# EasyEDA Pro project RoboHotHouse.eprj

# Schematic Schematic1
Board Name: TestRelay; Create Date: 2025-10-12; Page Name: P1; Project Name: RoboHotHouse; Schematic Name: Schematic1; Update Date: 2025-10-13; Company: EasyEDA.com; Page Size: A4; Version: V1.0
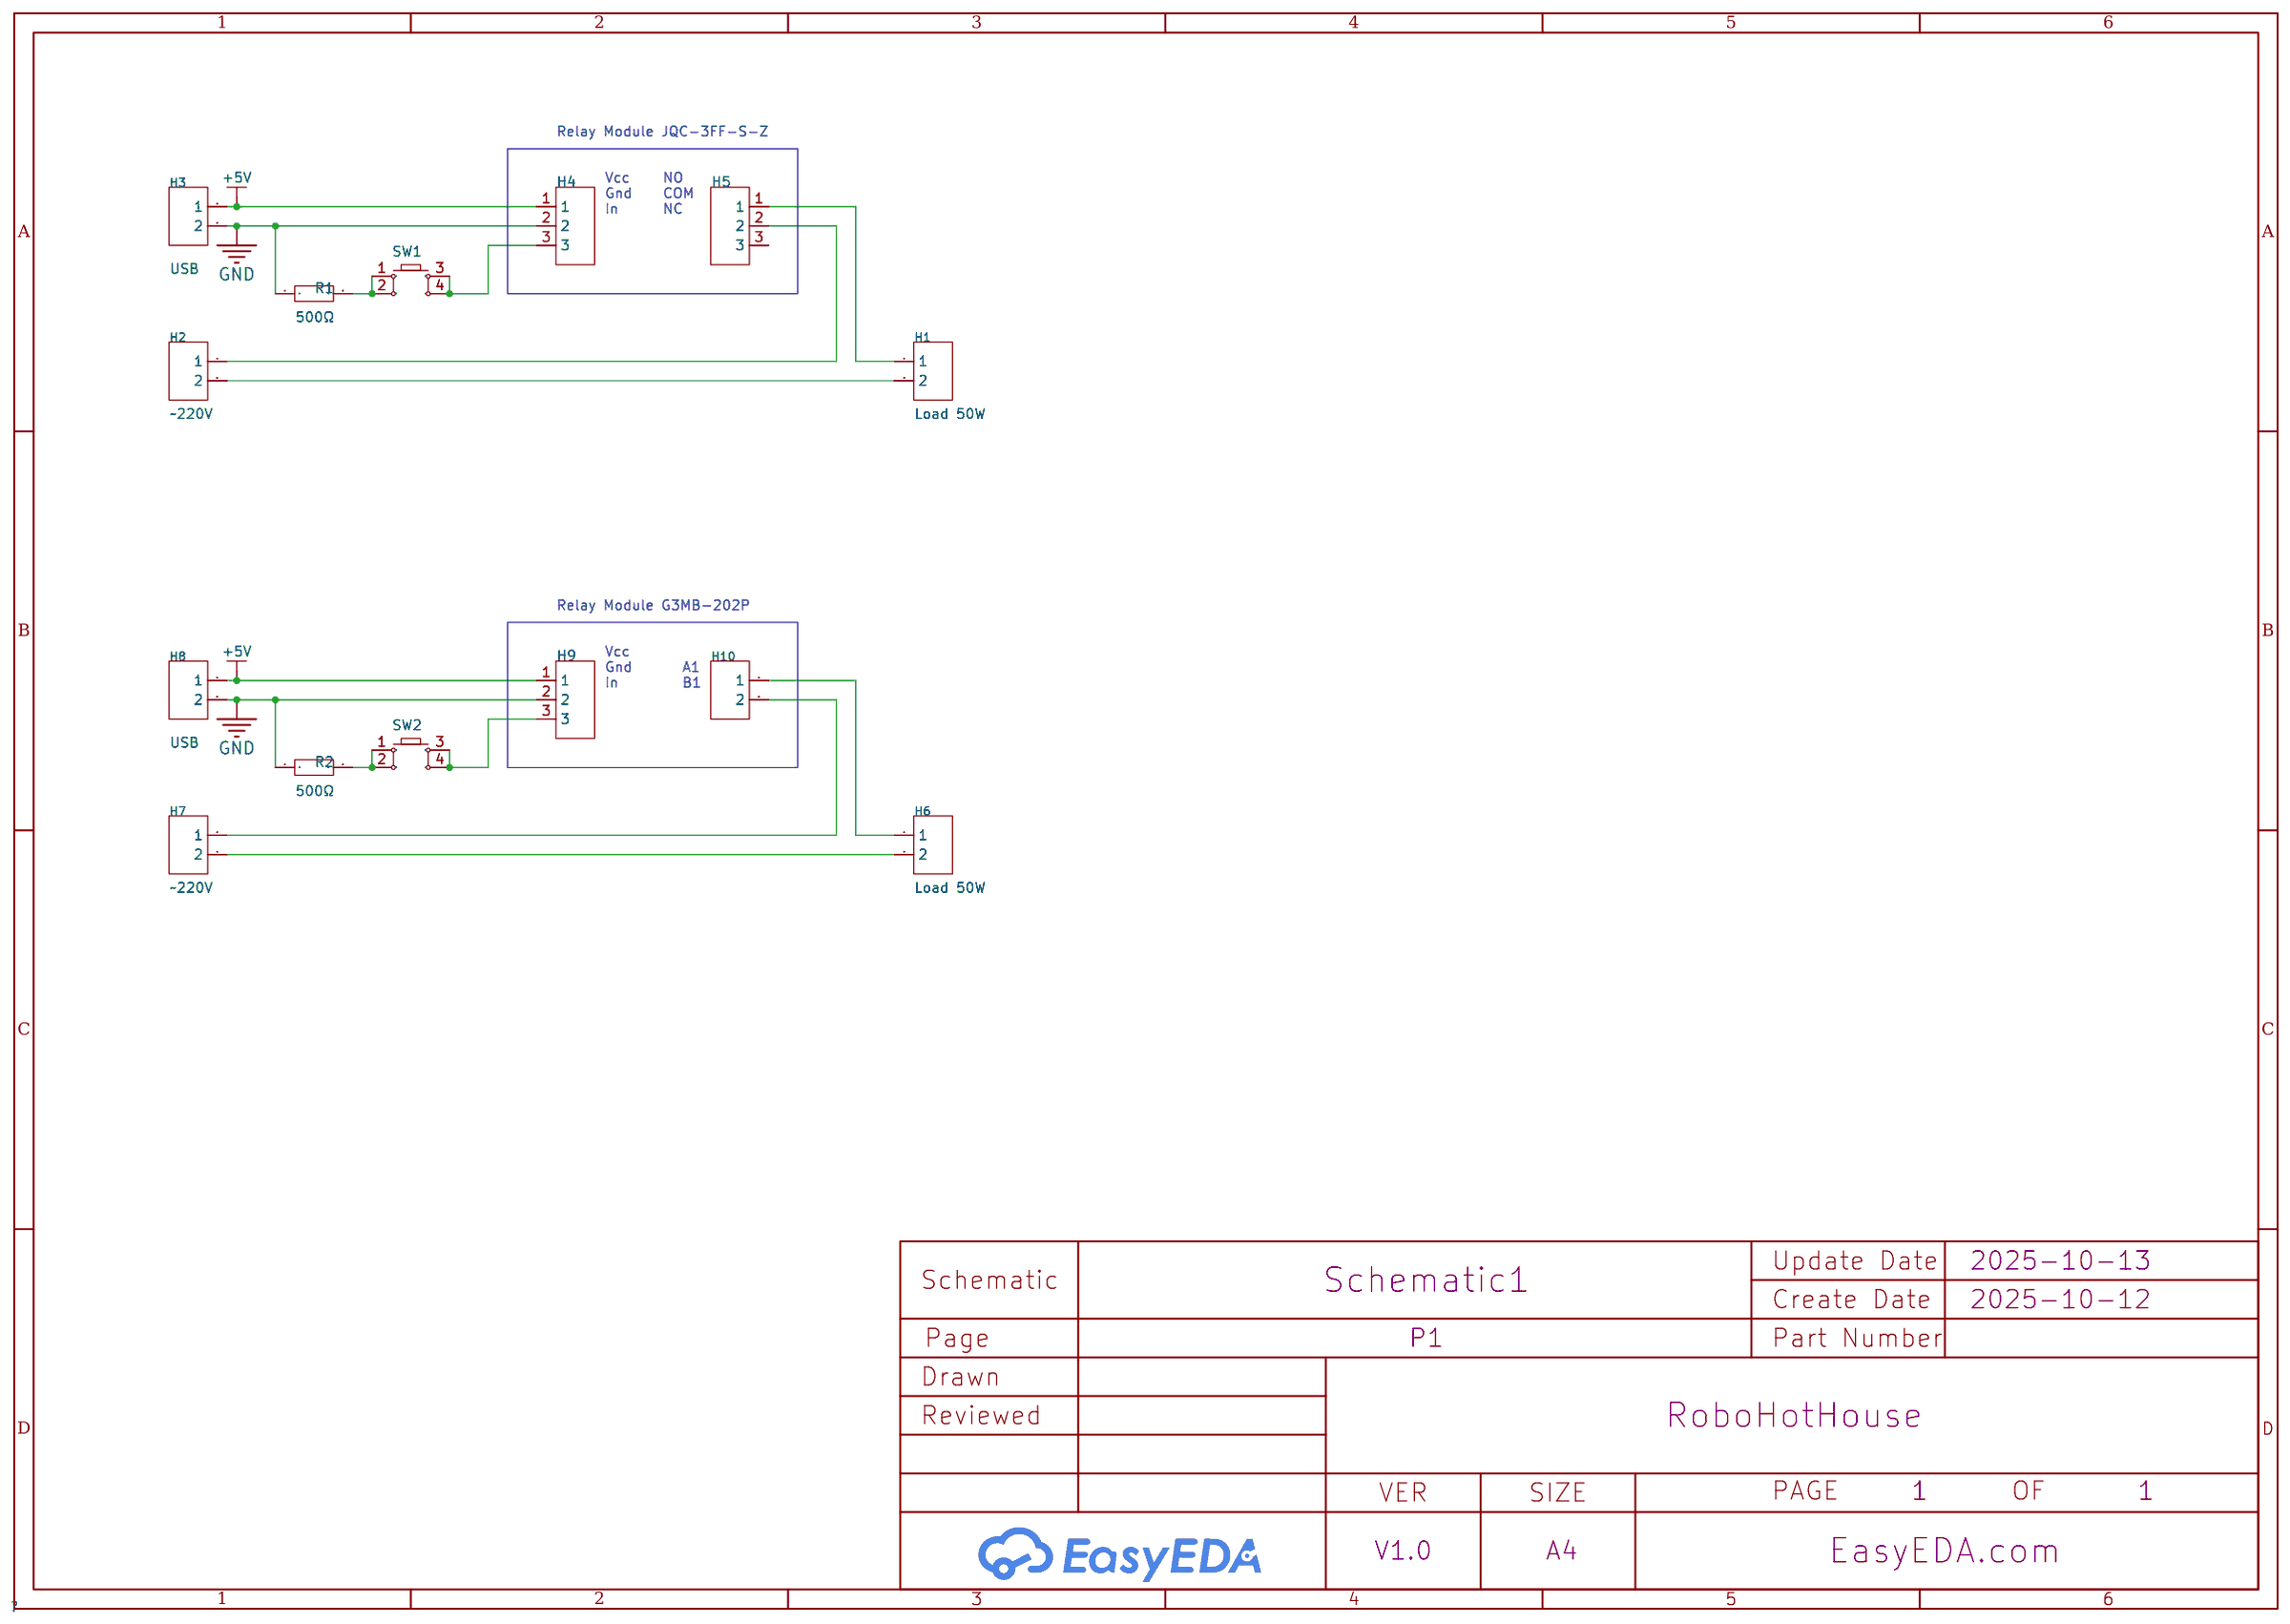
[diagram p0: schematic sheet]

## Parts
H1  Load 50W  [HDR-TH_2P-P2.54-V-F]
H2  220V  [HDR-TH_2P-P2.54-V-F]
H3  USB  [HDR-TH_2P-P2.54-V-F]
H4  -  [HDR-TH_3P-P2.54-V-F]
H5  -  [HDR-TH_3P-P2.54-V-F]
H6  Load 50W  [HDR-TH_2P-P2.54-V-F]
H7  220V  [HDR-TH_2P-P2.54-V-F]
H8  USB  [HDR-TH_2P-P2.54-V-F]
H9  -  [HDR-TH_3P-P2.54-V-F]
H10  -  [HDR-TH_2P-P2.54-V-F]
R1  500Ω  [RES-TH_BD1.8-L3.2-P7.20-D0.4]
R2  500Ω  [RES-TH_BD1.8-L3.2-P7.20-D0.4]
SW1  -  [KEY-TH_4P-L6.0-W6.0-P3.90-LS6.5]
SW2  -  [KEY-TH_4P-L6.0-W6.0-P3.90-LS6.5]

## Library data of the parts
H1-H3 H6-H8 H10 = HDR-F_2.54_1x2P: Supplier Footprint: Through
H4 H5 H9 = HDR-F_2.54_1x3P: Supplier Footprint: Through
R1 R2 = Res_AXIAL-1/8W: Supplier Footprint: Through
SW1 SW2 = Key_TH_6x6x4.5: Supplier Footprint: Through

## Nets
+5V: H3.1 H4.1 H8.1 H9.1
GND: H3.2 H4.2 H8.2 H9.2 R1.1 R2.1
Net-(H1-1): H1.1 H5.1
Net-(H1-2): H1.2 H2.2
Net-(H2-1): H2.1 H5.2
Net-(H4-3): H4.3 SW1.3 SW1.4
Net-(H6-1): H6.1 H10.1
Net-(H6-2): H6.2 H7.2
Net-(H7-1): H7.1 H10.2
Net-(H9-3): H9.3 SW2.3 SW2.4
Net-(R1-2): R1.2 SW1.1 SW1.2
Net-(R2-2): R2.2 SW2.1 SW2.2

Not connected (* = marked no-connect by the designer): H5 3

## Notes on the sheet
- Relay Module JQC-3FF-S-Z
- Vcc
  Gnd
  In
- NO
  COM
  NC
- Relay Module G3MB-202P
- Vcc
  Gnd
  In
- A1
  B1

# Schematic Schematic2

## Sheets
1 P1: Board Name: HotHouseProto; Create Date: 2025-11-25; Page Name: P1; Project Name: RoboHotHouse; Schematic Name: Schematic2; Update Date: 2025-11-30; Company: EasyEDA.com; Page Size: A4; Version: V1.0
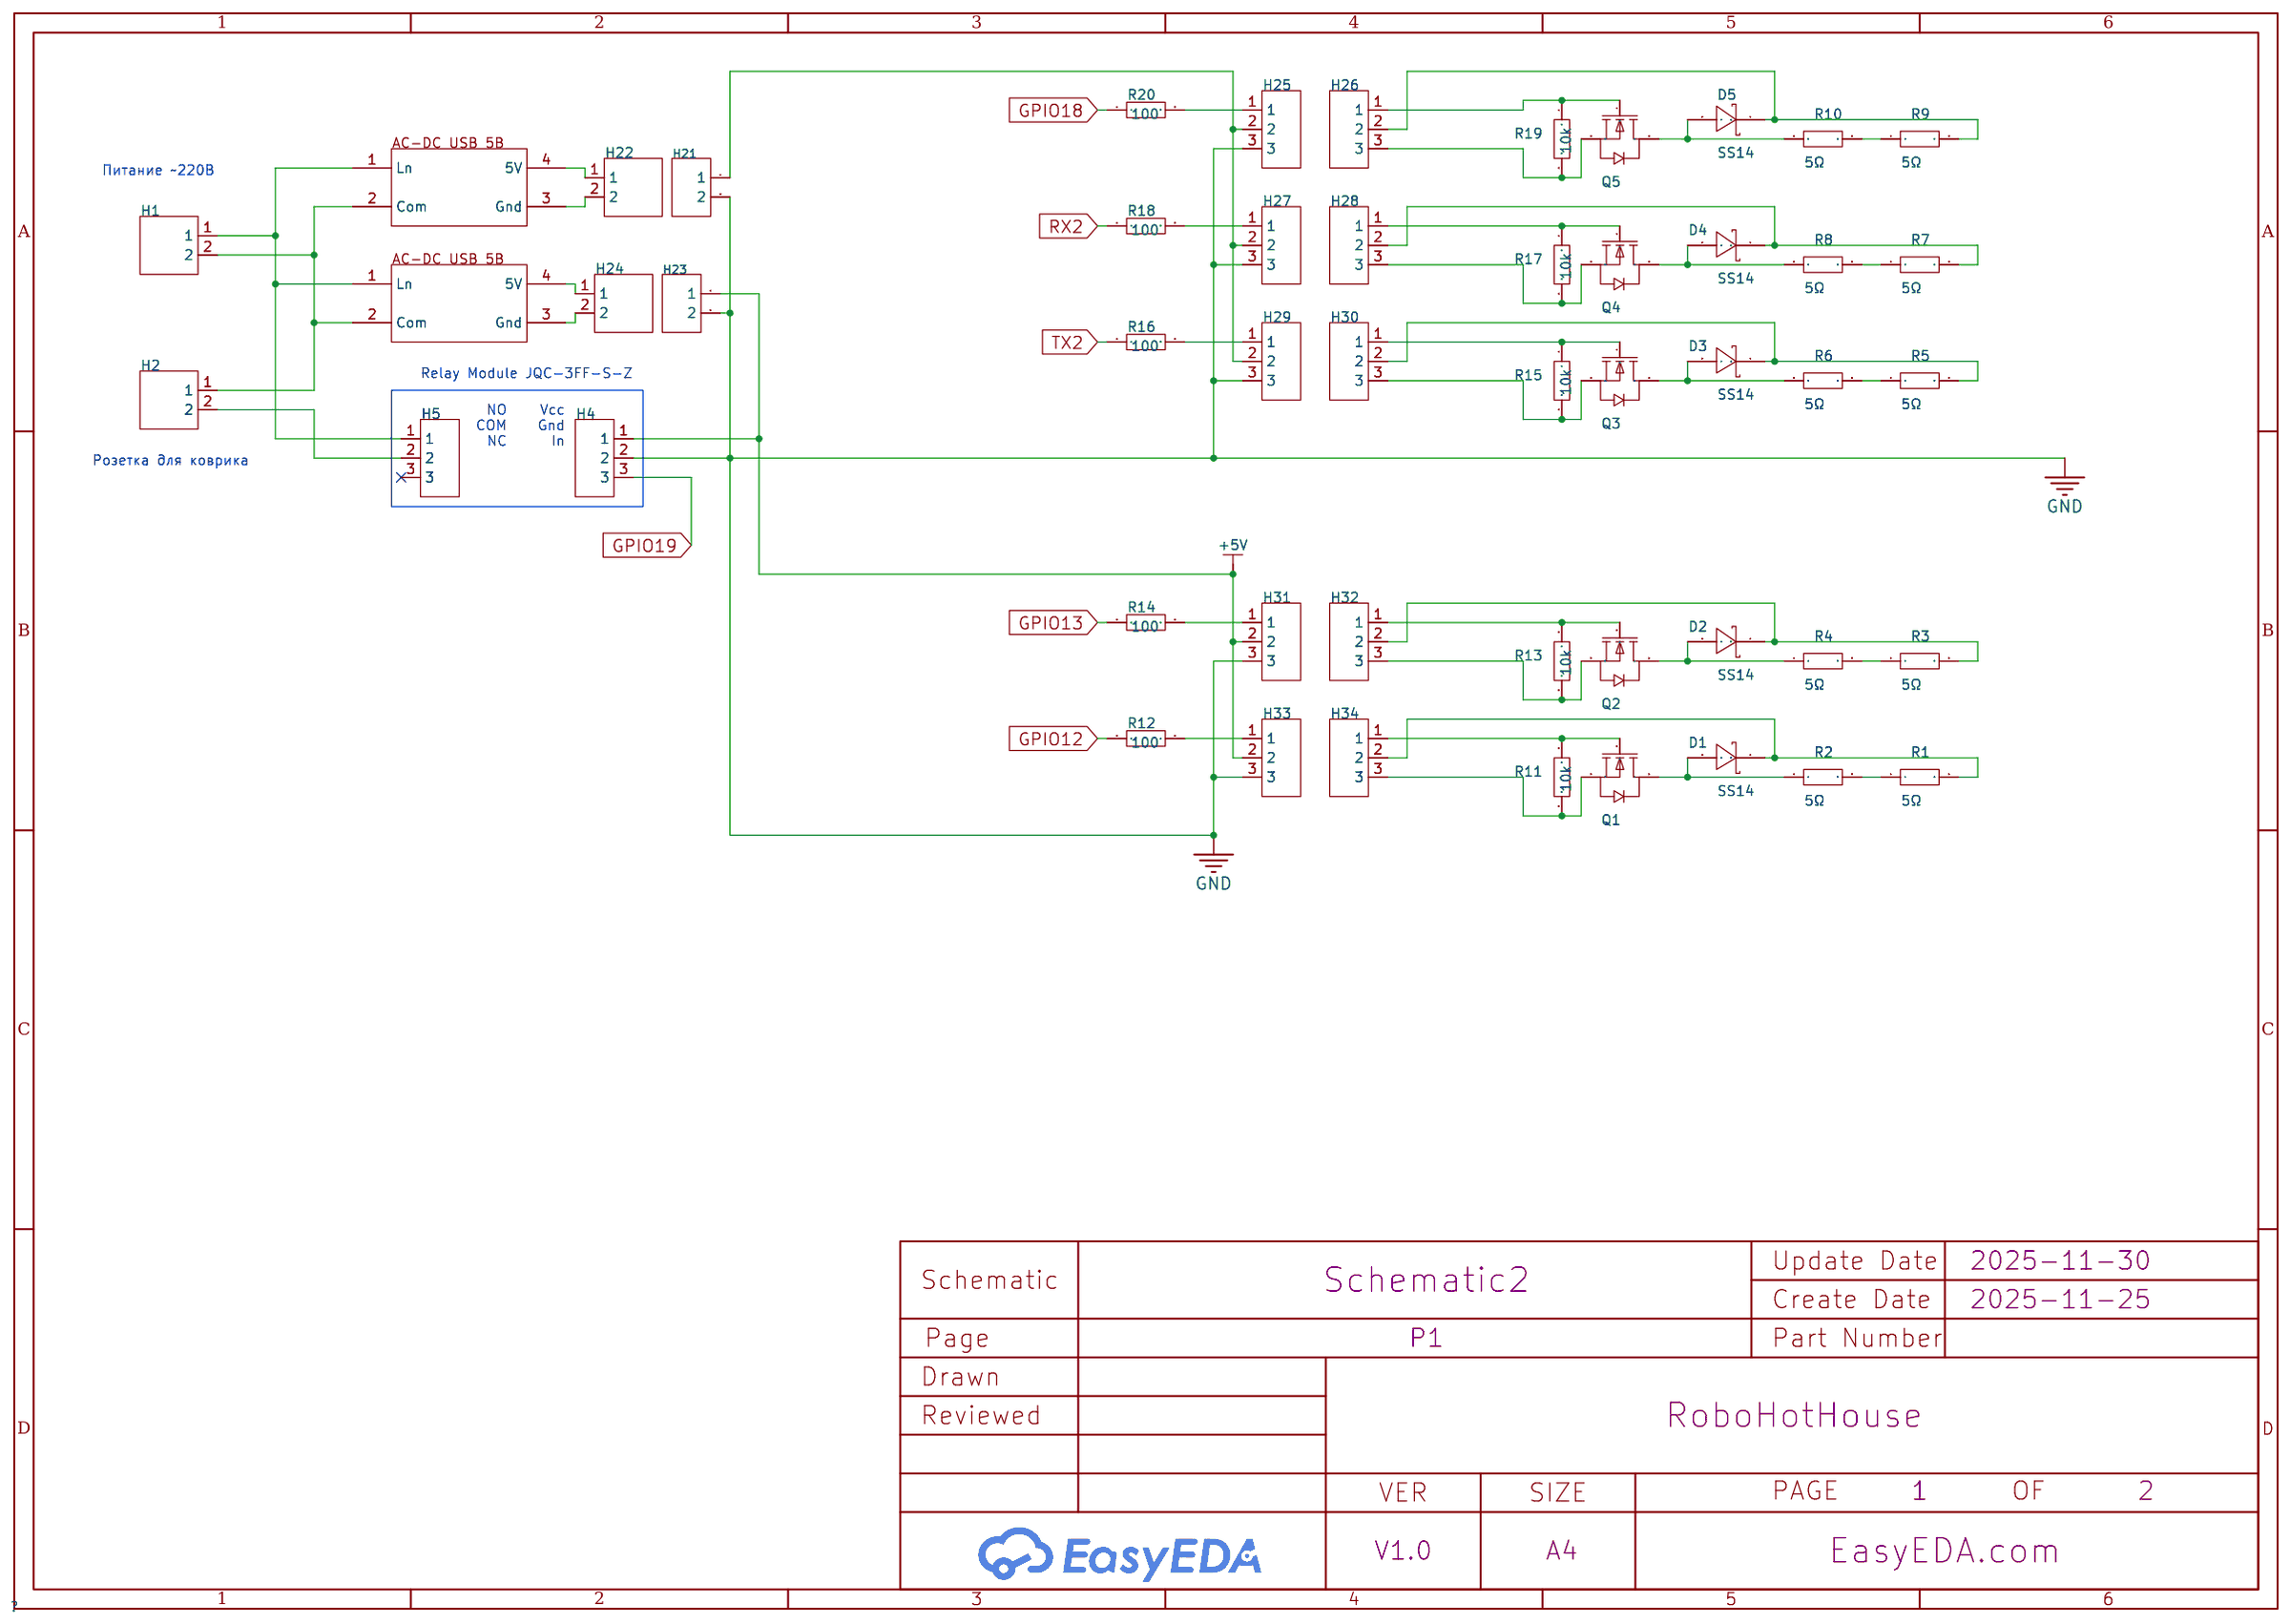
[diagram p1: P1]
2 P2: Create Date: 2025-11-27; Page Name: P2; Update Date: 2025-12-01
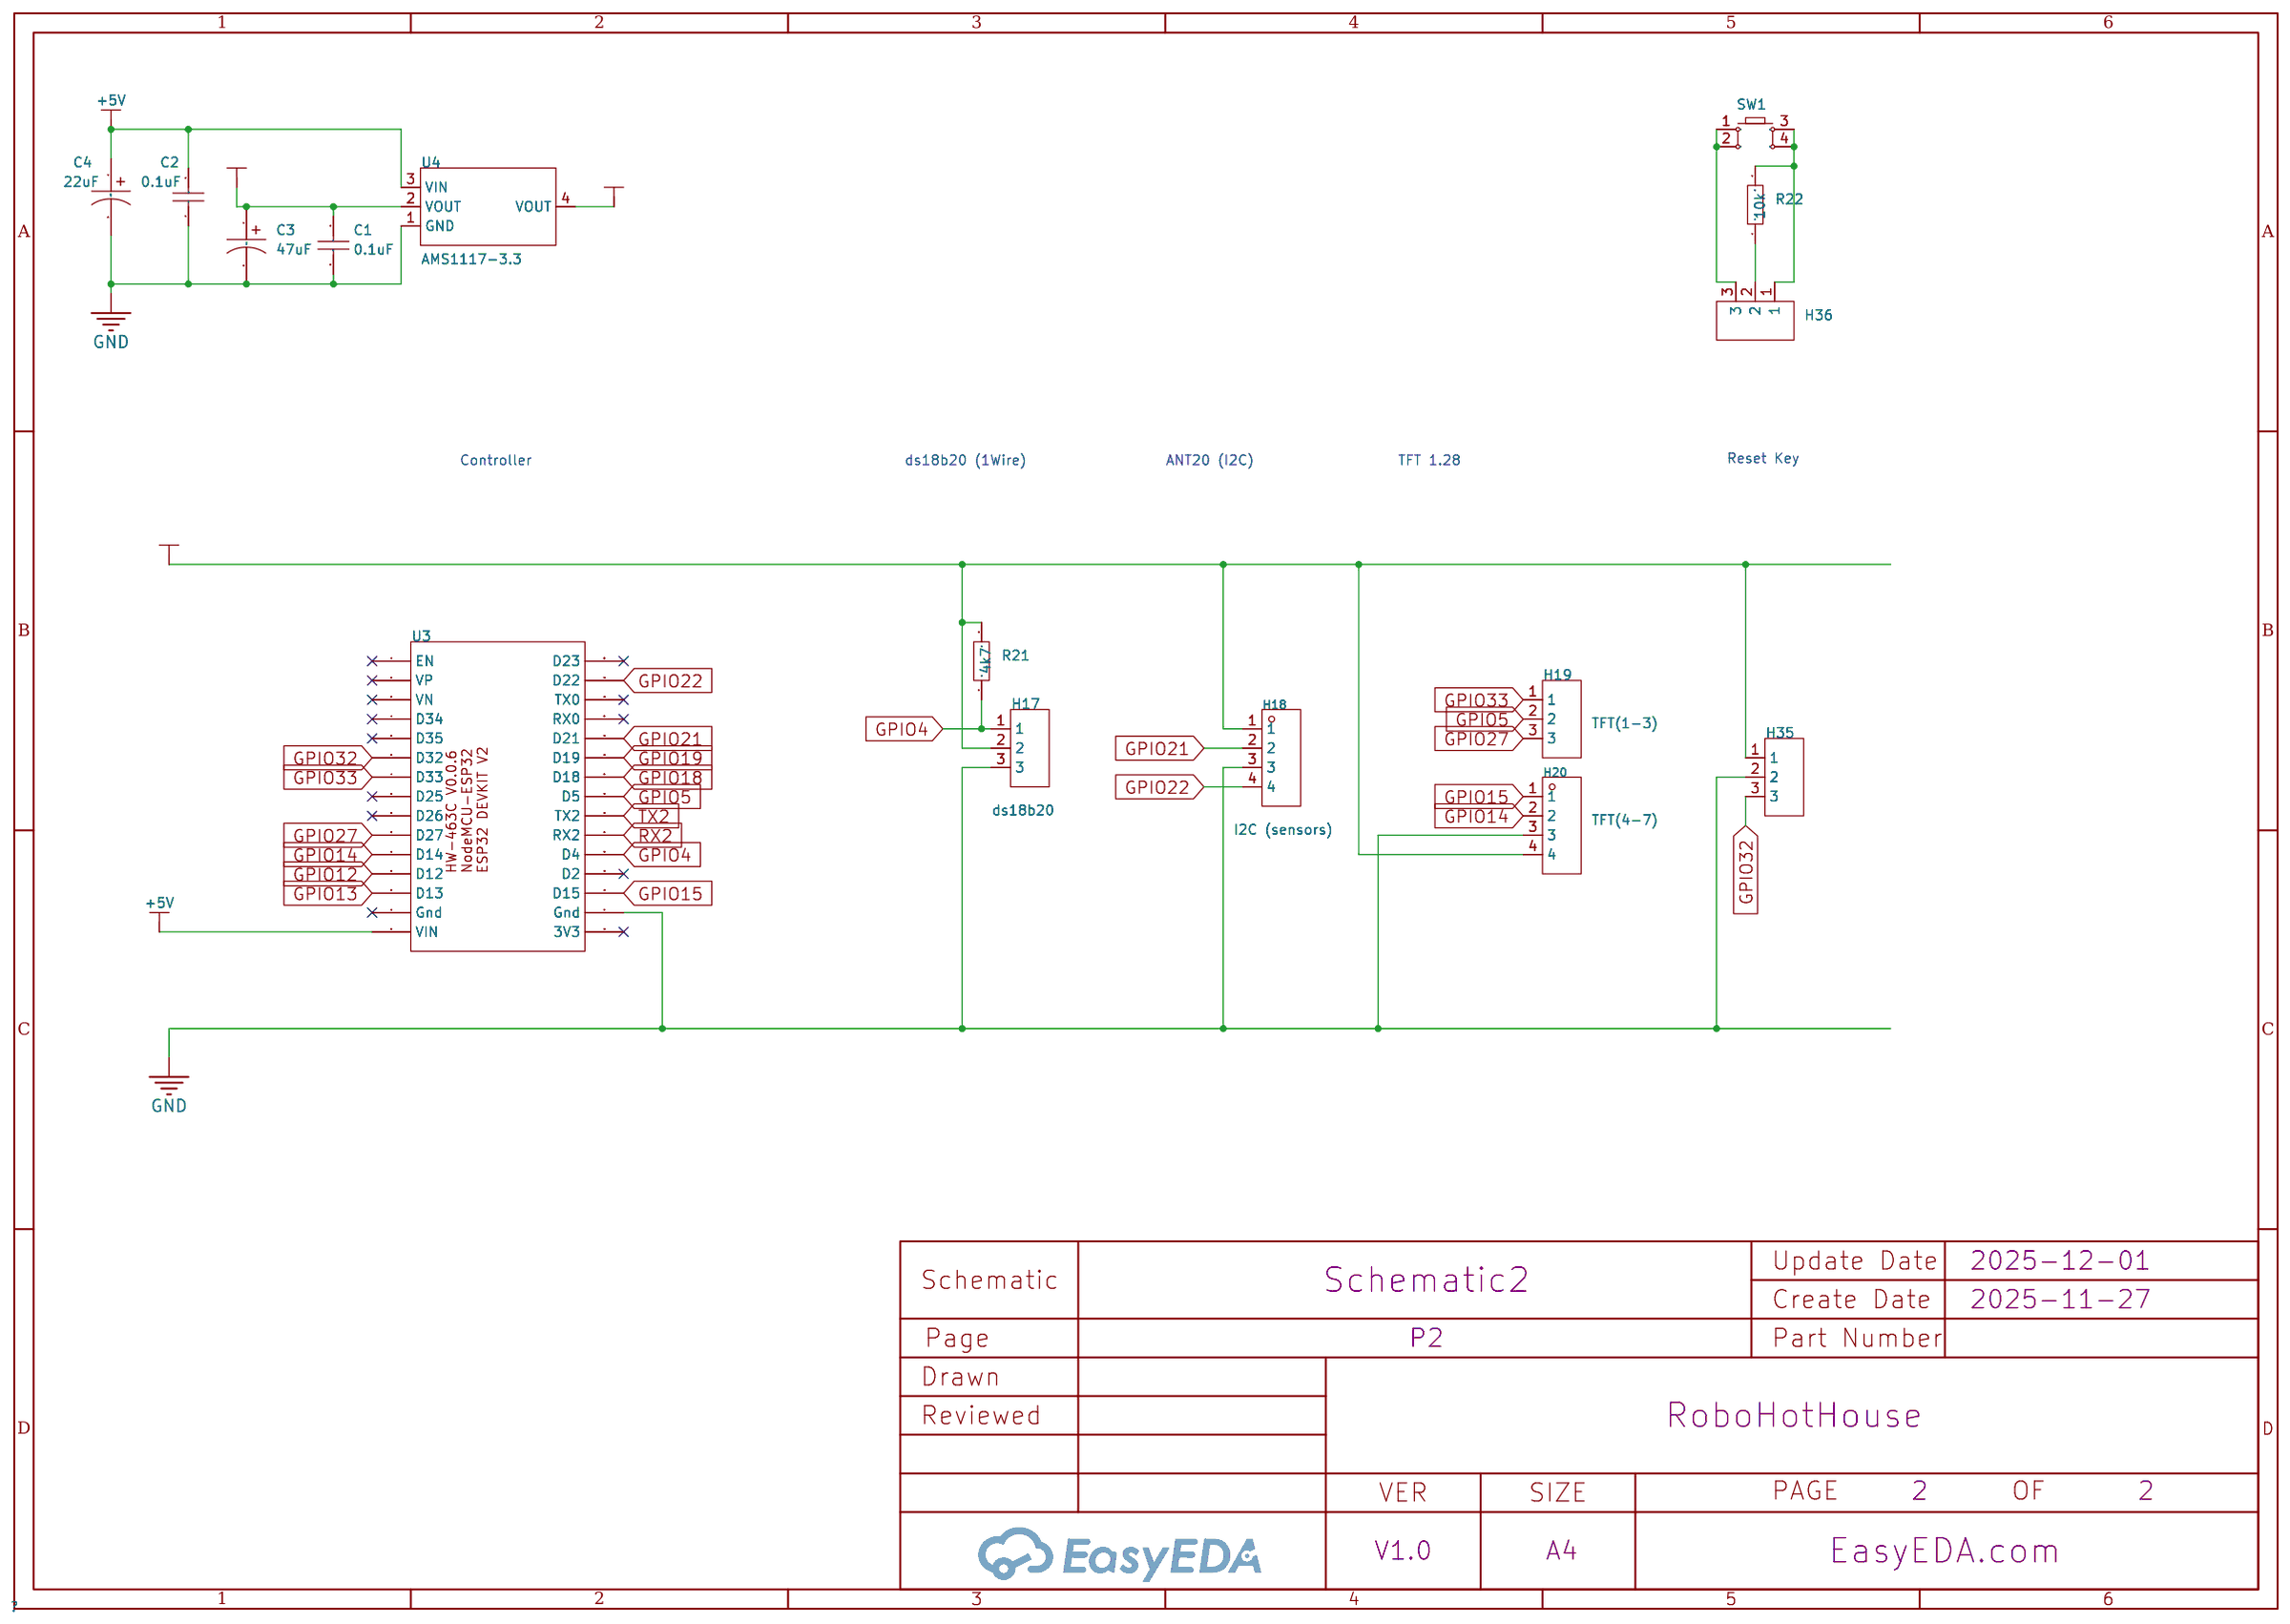
[diagram p2: P2]

## Parts
sheet P1
D1  SS14  [SMA_L4.4-W2.6-LS5.0-RD]
D2  SS14  [SMA_L4.4-W2.6-LS5.0-RD]
D3  SS14  [SMA_L4.4-W2.6-LS5.0-RD]
D4  SS14  [SMA_L4.4-W2.6-LS5.0-RD]
D5  SS14  [SMA_L4.4-W2.6-LS5.0-RD]
H1  -  [HDR-TH_2P-P2.54-V-M-1]
H2  -  [HDR-TH_2P-P2.54-V-M-1]
H4  -  [JST 2.54 3 pin]
H5  -  [HDR-TH_3P-P2.54-V-F]
H21  -  [JST 2.54 2 pin]
H22  -  [HDR-TH_2P-P2.54-V-M-1]
H23  -  [JST 2.54 2 pin]
H24  -  [HDR-TH_2P-P2.54-V-M-1]
H25  -  [JST 2.54 3 pin]
H26  -  [HDR-TH_3P-P2.54-V-F]
H27  -  [JST 2.54 3 pin]
H28  -  [HDR-TH_3P-P2.54-V-F]
H29  -  [JST 2.54 3 pin]
H30  -  [HDR-TH_3P-P2.54-V-F]
H31  -  [JST 2.54 3 pin]
H32  -  [HDR-TH_3P-P2.54-V-F]
H33  -  [JST 2.54 3 pin]
H34  -  [HDR-TH_3P-P2.54-V-F]
Q1  DMN2056U-7  [SOT-23-3_L2.9-W1.6-P1.90-LS2.8-BR]
Q2  DMN2056U-7  [SOT-23-3_L2.9-W1.6-P1.90-LS2.8-BR]
Q3  DMN2056U-7  [SOT-23-3_L2.9-W1.6-P1.90-LS2.8-BR]
Q4  DMN2056U-7  [SOT-23-3_L2.9-W1.6-P1.90-LS2.8-BR]
Q5  DMN2056U-7  [SOT-23-3_L2.9-W1.6-P1.90-LS2.8-BR]
R1  5Ω  [RES-TH_BD8.0-L24.5-P28.50-D0.8]
R2  5Ω  [RES-TH_BD8.0-L24.5-P28.50-D0.8]
R3  5Ω  [RES-TH_BD8.0-L24.5-P28.50-D0.8]
R4  5Ω  [RES-TH_BD8.0-L24.5-P28.50-D0.8]
R5  5Ω  [RES-TH_BD8.0-L24.5-P28.50-D0.8]
R6  5Ω  [RES-TH_BD8.0-L24.5-P28.50-D0.8]
R7  5Ω  [RES-TH_BD8.0-L24.5-P28.50-D0.8]
R8  5Ω  [RES-TH_BD8.0-L24.5-P28.50-D0.8]
R9  5Ω  [RES-TH_BD8.0-L24.5-P28.50-D0.8]
R10  5Ω  [RES-TH_BD8.0-L24.5-P28.50-D0.8]
R11  10k  [R1206]
R12  100  [R1206]
R13  10k  [R1206]
R14  100  [R1206]
R15  10k  [R1206]
R16  100  [R1206]
R17  10k  [R1206]
R18  100  [R1206]
R19  10k  [R1206]
R20  100  [R1206]
U1  -  [AC-DC USB 5В]
U2  -  [AC-DC USB 5В]
sheet P2
C1  0.1uF  [C1206]
C2  0.1uF  [C1206]
C3  47uF  [CAP-TH_BD8.0-P3.50-D0.6-FD]
C4  22uF  [CAP-TH_BD8.0-P3.50-D0.6-FD]
H17  ds18b20  [JST 2.54 3 pin]
H18  I2C (sensors)  [JST 2.54*4]
H19  TFT(1-3)  [JST 2.54 3 pin]
H20  TFT(4-7)  [JST 2.54*4]
H35  -  [HDR-TH_3P-P2.54-V-F]
H36  -  [HDR-TH_3P-P2.54-V-M]
R21  4k7  [R1206]
R22  10k  [R_AXIAL-0.4]
SW1  -  [KEY-TH_4P-L6.0-W6.0-P3.90-LS6.5]
U3  -  [ESP32 DEVKIT V1]
U4  AMS1117-3.3  [SOT-223-3_L6.5-W3.4-P2.30-LS7.0-BR]

## Library data of the parts
D1-D5 = SS14: LCSC Part Name: 电压:40V 电流:1A; Supplier Part: C142447; Supplier Footprint: SMA(DO-214AC); JLCPCB Part Class: Extended Part; Datasheet: https://atta.szlcsc.com/upload/public/pdf/source/20190322/C379821_5D26BA1C5F5EA8B5D45155DFF6415525.pdf; Supplier: LCSC; Forward Voltage (Vf@If): 500mV@1A; Reverse Voltage (Vr): 40V; Average Rectified Current (Io): 1A
H1 H2 H22 H24 = HDR-M_2.54_1x2P: Supplier Footprint: Through
H4 H5 H17 H19 H25-H35 = HDR-F_2.54_1x3P: Supplier Footprint: Through
H21 H23 = HDR-F_2.54_1x2P: Supplier Footprint: Through
Q1-Q5 = DMN2056U-7: LCSC Part Name: 1个N沟道 耐压:20V 电流:4A; Supplier Part: C332302; Manufacturer: DIODES(美台); Supplier Footprint: SOT-23; JLCPCB Part Class: Extended Part; Datasheet: https://item.szlcsc.com/datasheet/DMN2056U-7/311108.html; Supplier: LCSC; Number: 1 N-Channel; Drain to Source Voltage: 20V; Current - Continuous Drain(Id): 4A; RDS(on): 45mΩ@2.5V; Pd - Power Dissipation: 940mW; Gate Threshold Voltage (Vgs(th)): 1V@250uA; Gate Charge(Qg): 4.3nC@4.5V; Input Capacitance(Ciss): 339pF; Reverse Transfer Capacitance (Crss@Vds): 34pF; Operating Temperature: -55℃~+150℃; Type: N-Channel; Output Capacitance(Coss): 47pF
R1-R10 = Res_AXIAL-5W: Supplier Footprint: Through
R11-R21 = Res_1206: Supplier Footprint: 1206
U1 U2 = AC-DC USB 5В 2А
C1 C2 = CL31A107MQHNNNE: LCSC Part Name: 100uF ±20% 6.3V; Supplier Part: C15008; Manufacturer: SAMSUNG(三星); Supplier Footprint: 1206; JLCPCB Part Class: Basic Part; Datasheet: https://item.szlcsc.com/datasheet/CL31A107MQHNNNE/15681.html; Supplier: LCSC; Tolerance: ±20%; Voltage Rating: 6.3V; Temperature Coefficient: X5R
C3 C4 = Capacitor_THT:CP_Radial_D8.0mm_P2.50mm: Supplier Part: C9900016268; Supplier Footprint: 470uF_25V; JLCPCB Part Class: Extended Part; Supplier: LCSC
H18 H20 = HDR-F_2.54_1x4P: Supplier Footprint: Through
H36 = HDR-M_2.54_1x3P: Supplier Footprint: Through
R22 = Res_AXIAL-1/4W: Supplier Footprint: Through
SW1 = Key_TH_6x6x4.5: Supplier Footprint: Through
U3 = ESP32 DEVKITV1
U4 = AMS1117-3.3_C6186: LCSC Part Name: 输出3.3V 1A; Supplier Part: C6186; Manufacturer: AMS; Supplier Footprint: SOT-223; JLCPCB Part Class: Basic Part; Datasheet: https://item.szlcsc.com/datasheet/AMS1117-3.3/6652.html; Supplier: LCSC; Output Type: Fixed; Voltage - Supply: 16V; Output Voltage: 3.3V; Output Current: 1A; Power Supply Rejection Ratio (PSRR): 72dB@(120Hz); Voltage Dropout: 1.1V@(800mA); standby current: 5mA; Noise: 0.003%Vout; Features: Over Current Protection；Over Temperature Protection; Operating Temperature: -40℃~+125℃; Output Configuration: Positive; Number of Outputs: 1

## Nets
+3V3: C1.2 C3.1 H17.2 H18.1 H20.4 H35.1 R21.2 U4.2(VOUT) U4.4(VOUT)
+5V: C2.2 C4.1 H4.1 H23.1 H31.2 H33.2 U3.15(VIN) U4.3(VIN)
GND: C1.1 C2.1 C3.2 C4.2 H4.2 H17.3 H18.3 H20.3 H21.2 H23.2 H25.3 H27.3 H29.3 H31.3 H33.3 H35.2 U3.17(Gnd) U4.1(GND)
GPIO4: H17.1 R21.1 U3.20(D4)
GPIO5: H19.2 U3.23(D5)
GPIO12: R12.1 U3.12(D12)
GPIO13: R14.1 U3.13(D13)
GPIO14: H20.2 U3.11(D14)
GPIO15: H20.1 U3.18(D15)
GPIO18: R20.1 U3.24(D18)
GPIO19: H4.3 U3.25(D19)
GPIO21: H18.2 U3.26(D21)
GPIO22: H18.4 U3.29(D22)
GPIO27: H19.3 U3.10(D27)
GPIO32: H35.3 U3.6(D32)
GPIO33: H19.1 U3.7(D33)
RX2: R18.1 U3.21(RX2)
TX2: R16.1 U3.22(TX2)
$1N8540: H25.1 R20.2
$1N8670: H21.1 H25.2 H27.2 H29.2
$1N8905: H27.1 R18.2
$1N8909: H29.1 R16.2
$1N9454: H31.1 R14.2
$1N9461: H33.1 R12.2
Net-(D1-1): D1.1(C) H34.2 R1.2
Net-(D1-2): D1.2(A) Q1.3(D) R2.1
Net-(D2-1): D2.1(C) H32.2 R3.2
Net-(D2-2): D2.2(A) Q2.3(D) R4.1
Net-(D3-1): D3.1(C) H30.2 R5.2
Net-(D3-2): D3.2(A) Q3.3(D) R6.1
Net-(D4-1): D4.1(C) H28.2 R7.2
Net-(D4-2): D4.2(A) Q4.3(D) R8.1
Net-(D5-1): D5.1(C) H26.2 R9.2
Net-(D5-2): D5.2(A) Q5.3(D) R10.1
Net-(H1-1): H1.1 H5.1 U1.1(Ln) U2.1(Ln)
Net-(H1-2): H1.2 H2.1 U1.2(Com) U2.2(Com)
Net-(H2-2): H2.2 H5.2
Net-(H22-1): H22.1 U1.4(5V)
Net-(H22-2): H22.2 U1.3(Gnd)
Net-(H24-1): H24.1 U2.4(5V)
Net-(H24-2): H24.2 U2.3(Gnd)
Net-(H26-1): H26.1 Q5.1(G) R19.1
Net-(H26-3): H26.3 Q5.2(S) R19.2
Net-(H28-1): H28.1 Q4.1(G) R17.1
Net-(H28-3): H28.3 Q4.2(S) R17.2
Net-(H30-1): H30.1 Q3.1(G) R15.1
Net-(H30-3): H30.3 Q3.2(S) R15.2
Net-(H32-1): H32.1 Q2.1(G) R13.1
Net-(H32-3): H32.3 Q2.2(S) R13.2
Net-(H34-1): H34.1 Q1.1(G) R11.1
Net-(H34-3): H34.3 Q1.2(S) R11.2
Net-(H36-1): H36.1 R22.2 SW1.3 SW1.4
Net-(H36-2): H36.2 R22.1
Net-(H36-3): H36.3 SW1.1 SW1.2
Net-(R1-1): R1.1 R2.2
Net-(R3-1): R3.1 R4.2
Net-(R5-1): R5.1 R6.2
Net-(R7-1): R7.1 R8.2
Net-(R9-1): R9.1 R10.2

Not connected (* = marked no-connect by the designer): H5 3*; U3 1(EN)* 2(VP)* 3(VN)* 4(D34)* 5(D35)* 8(D25)* 9(D26)* 14(Gnd)* 16(3V3)* 19(D2)* 27(RX0)* 28(TX0)* 30(D23)*

## Notes on the sheets
sheet 1
- Питание ~220В
- Relay Module JQC-3FF-S-Z
- NO
  COM
  NC
- Vcc
  Gnd
  In
- Розетка для коврика
sheet 2
- Controller
- ds18b20 (1Wire)
- ANT20 (I2C)
- TFT 1.28
- Reset Key

# Schematic Schematic3
Board Name: HeatCell5V; Create Date: 2025-12-01; Page Name: P1; Project Name: RoboHotHouse; Schematic Name: Schematic3; Update Date: 2025-12-01; Company: EasyEDA.com; Page Size: A4; Version: V1.0
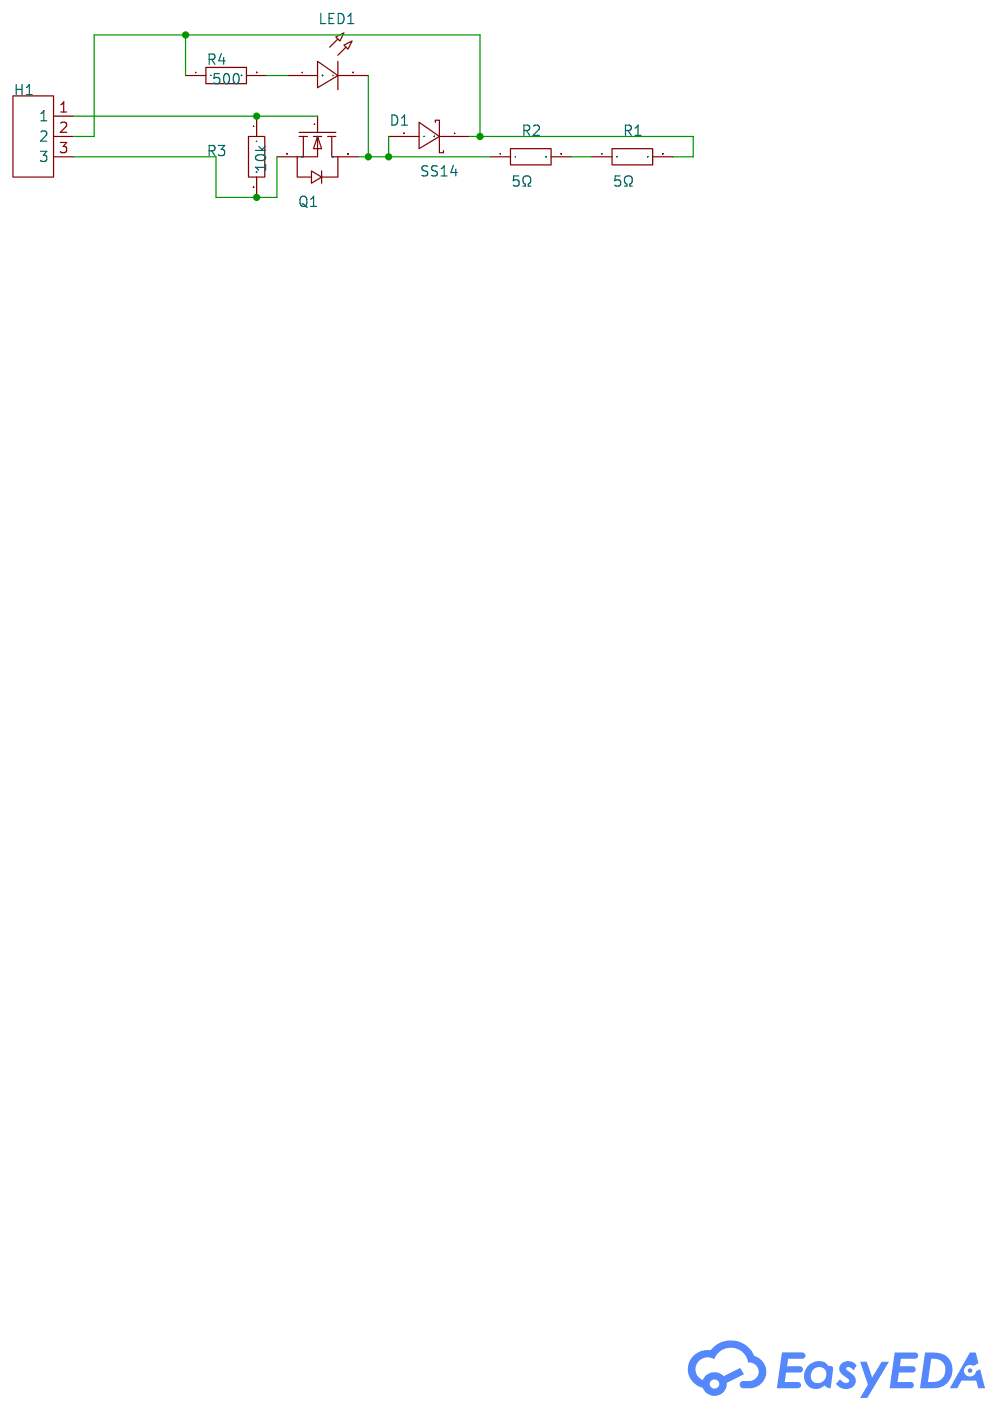
[diagram p3: schematic sheet]

## Parts
D1  SS14  [SMA_L4.4-W2.6-LS5.0-RD]
H1  -  [JST 2.54 3 pin]
LED1  -  [LED-TH_BD3.0-P2.54-FD]
Q1  DMN2056U-7  [SOT-23-3_L2.9-W1.6-P1.90-LS2.8-BR]
R1  5Ω  [RES-TH_BD8.0-L24.5-P28.50-D0.8]
R2  5Ω  [RES-TH_BD8.0-L24.5-P28.50-D0.8]
R3  10k  [R1206]
R4  500  [R1206]

## Library data of the parts
D1 = SS14: LCSC Part Name: 电压:40V 电流:1A; Supplier Part: C142447; Supplier Footprint: SMA(DO-214AC); JLCPCB Part Class: Extended Part; Datasheet: https://atta.szlcsc.com/upload/public/pdf/source/20190322/C379821_5D26BA1C5F5EA8B5D45155DFF6415525.pdf; Supplier: LCSC; Forward Voltage (Vf@If): 500mV@1A; Reverse Voltage (Vr): 40V; Average Rectified Current (Io): 1A
H1 = HDR-F_2.54_1x3P: Supplier Footprint: Through
LED1 = LED_TH-R_3mm: Supplier Footprint: Through
Q1 = DMN2056U-7: LCSC Part Name: 1个N沟道 耐压:20V 电流:4A; Supplier Part: C332302; Manufacturer: DIODES(美台); Supplier Footprint: SOT-23; JLCPCB Part Class: Extended Part; Datasheet: https://item.szlcsc.com/datasheet/DMN2056U-7/311108.html; Supplier: LCSC; Number: 1 N-Channel; Drain to Source Voltage: 20V; Current - Continuous Drain(Id): 4A; RDS(on): 45mΩ@2.5V; Pd - Power Dissipation: 940mW; Gate Threshold Voltage (Vgs(th)): 1V@250uA; Gate Charge(Qg): 4.3nC@4.5V; Input Capacitance(Ciss): 339pF; Reverse Transfer Capacitance (Crss@Vds): 34pF; Operating Temperature: -55℃~+150℃; Type: N-Channel; Output Capacitance(Coss): 47pF
R1 R2 = Res_AXIAL-5W: Supplier Footprint: Through
R3 R4 = Res_1206: Supplier Footprint: 1206

## Nets
$1N235: D1.1(C) H1.2 R1.2 R4.1
$1N244: H1.3 Q1.2(S) R3.2
$1N250: H1.1 Q1.1(G) R3.1
$1N253: D1.2(A) LED1.2(A) Q1.3(D) R2.1
$1N257: R1.1 R2.2
$1N463: LED1.1(C) R4.2

# Board PCB2
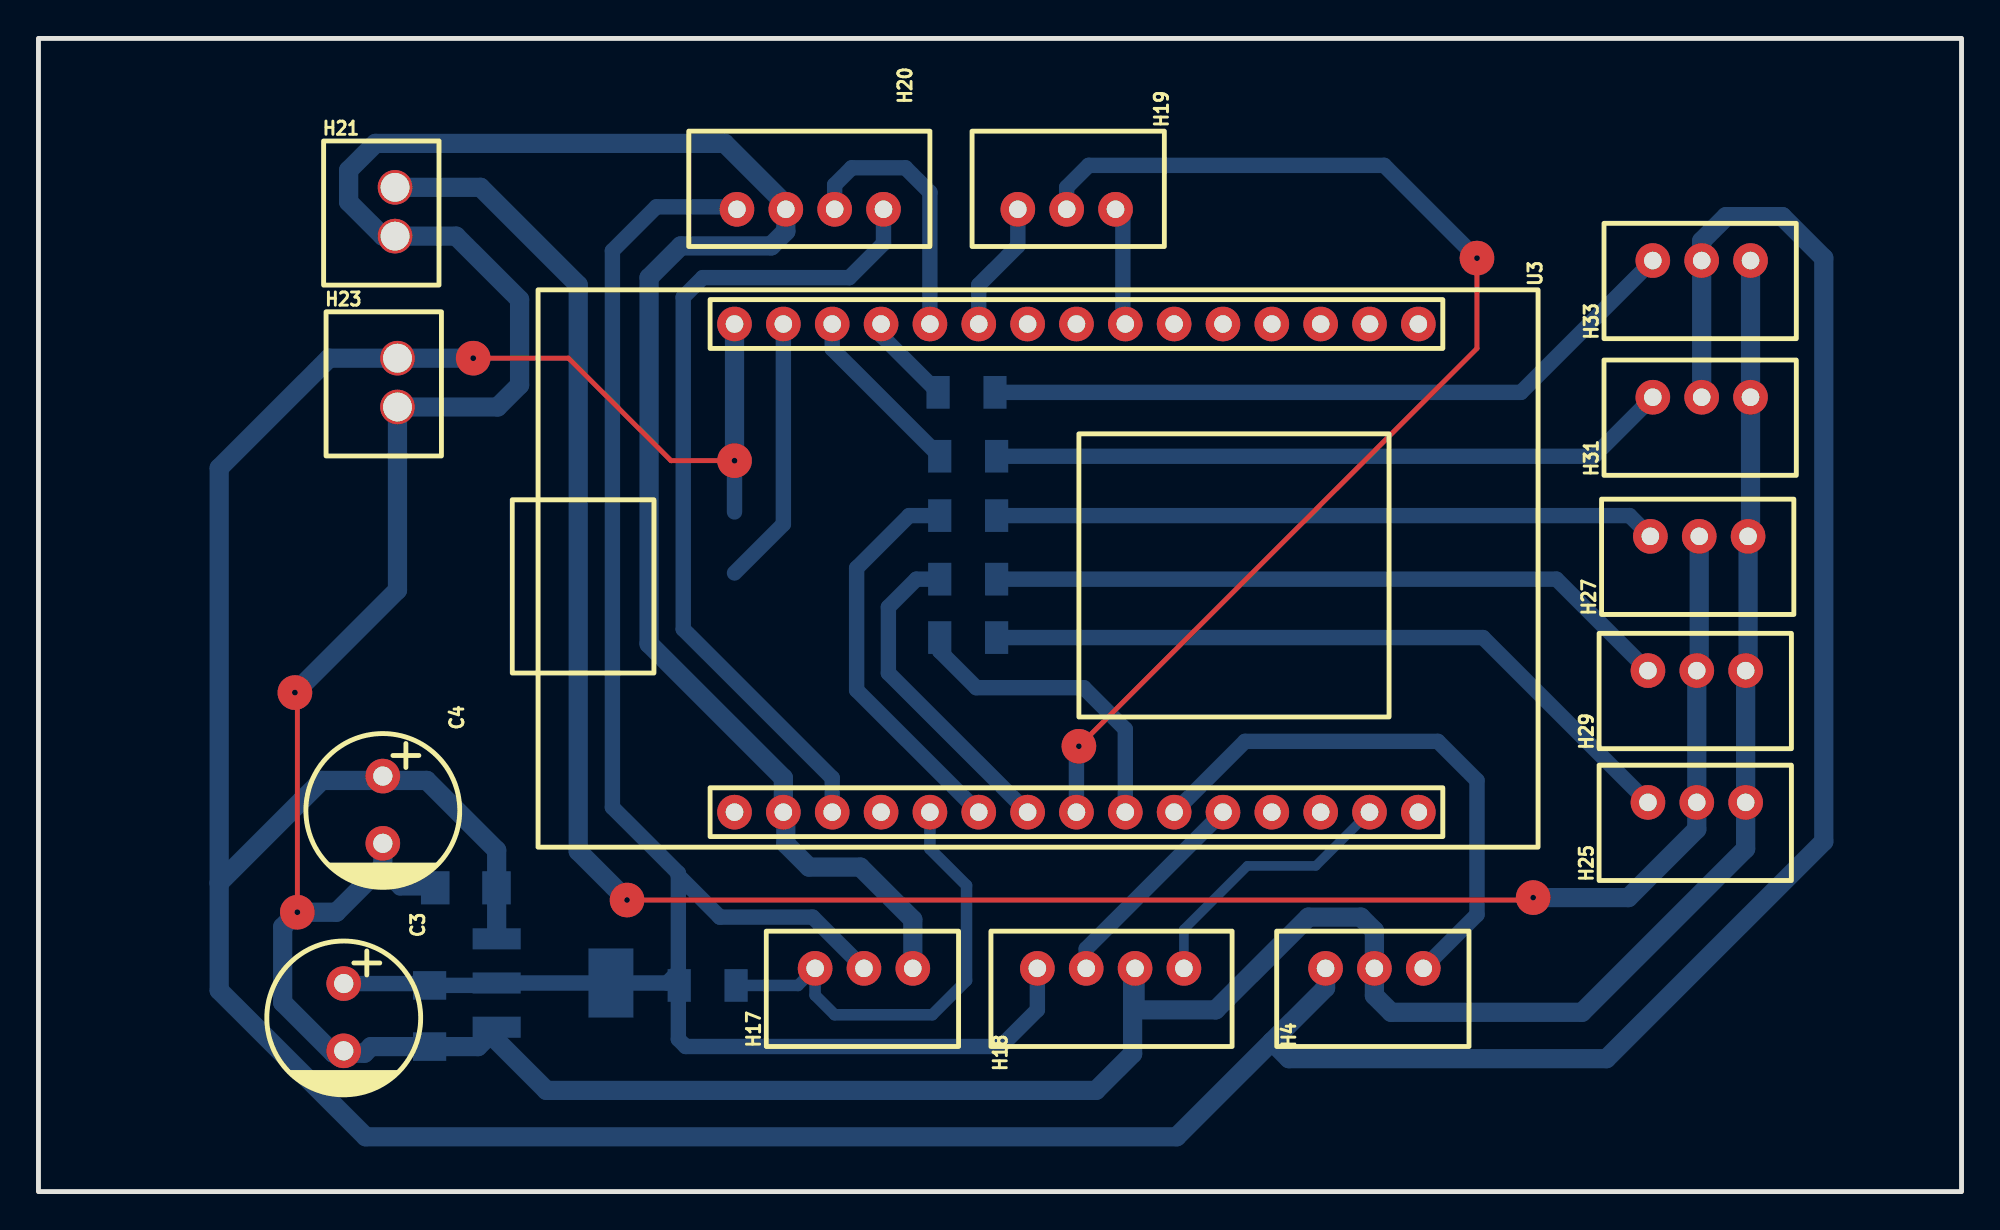
[diagram p4: board, top side]
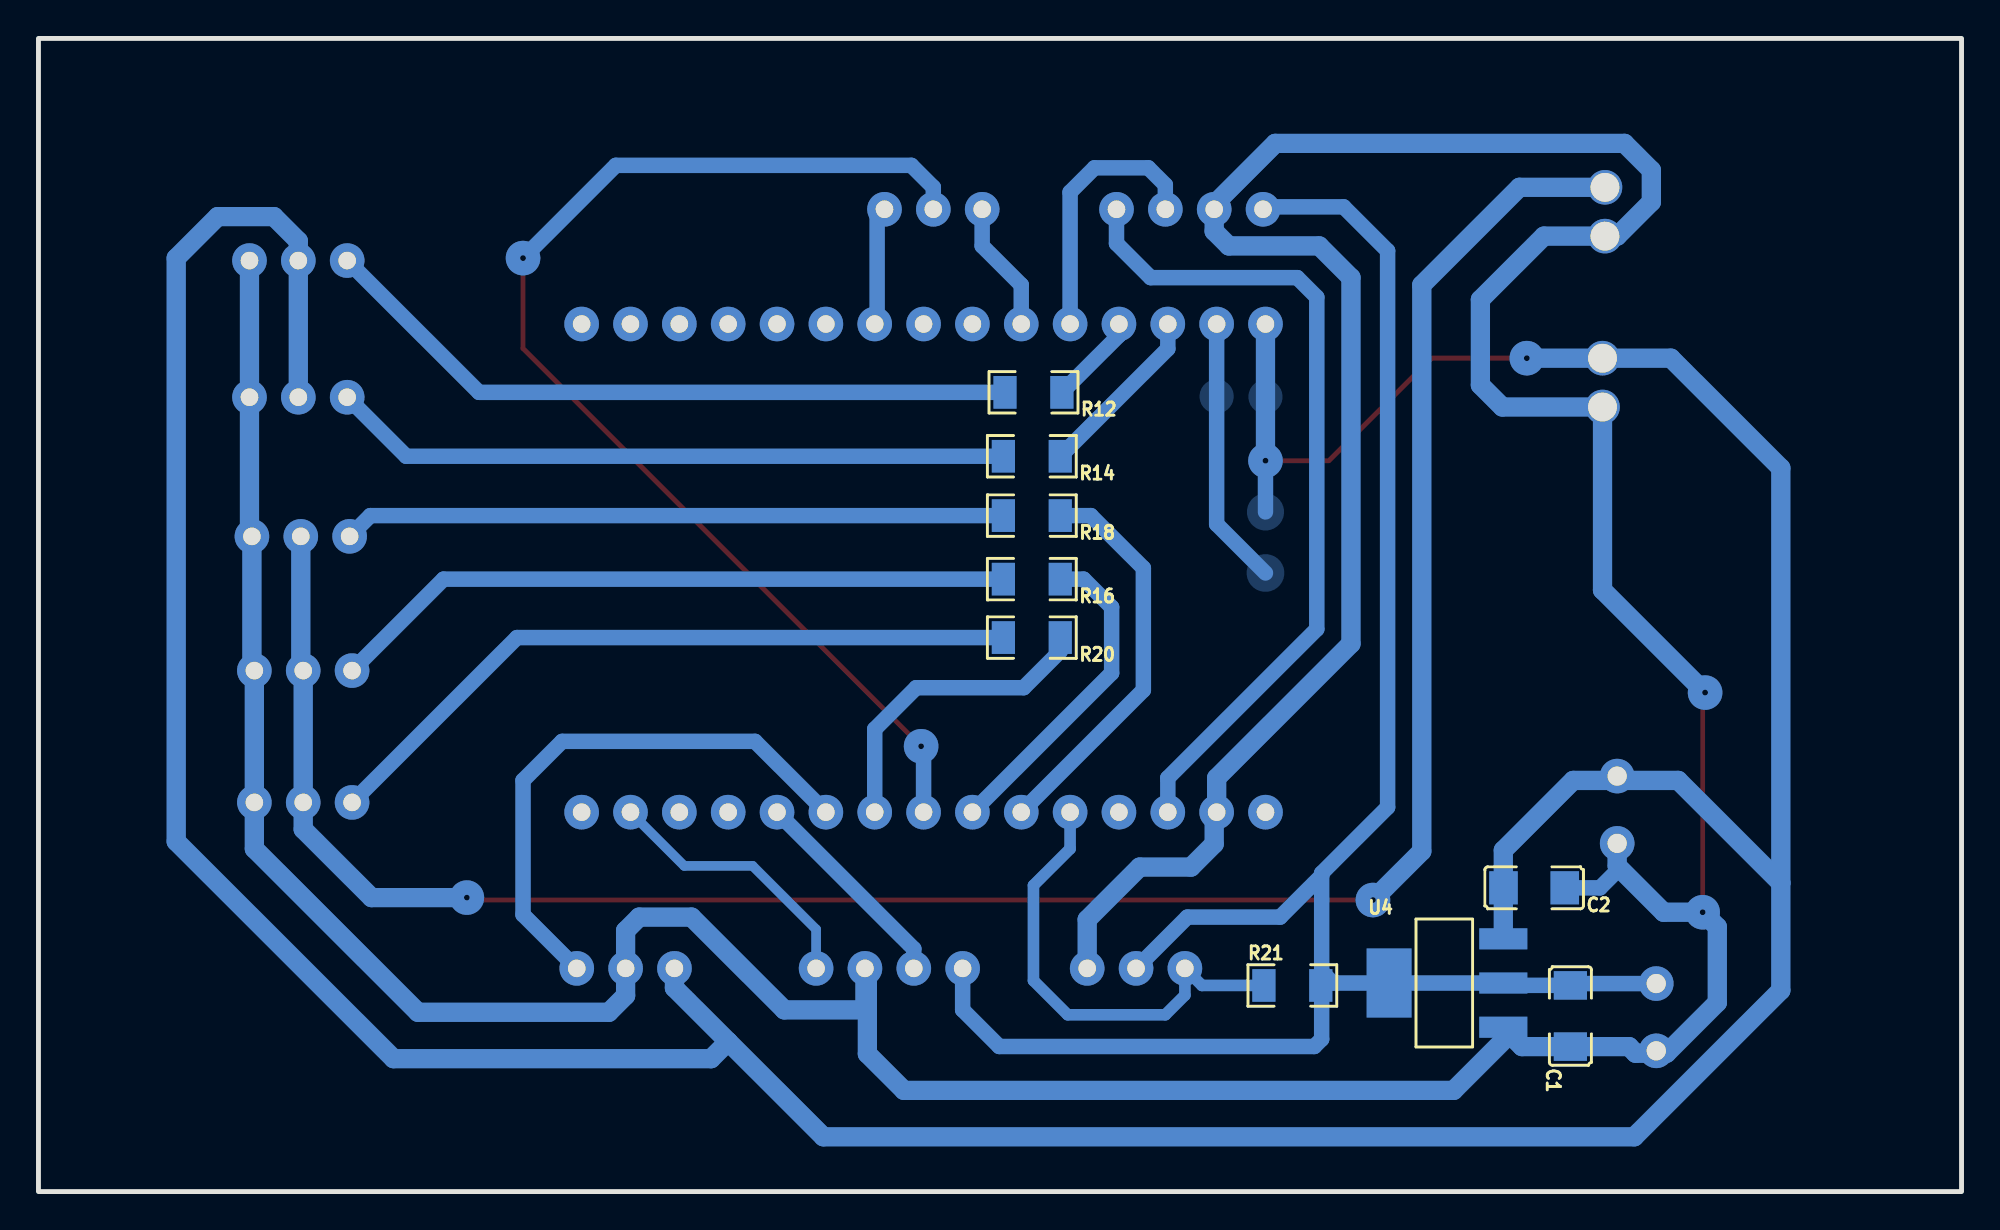
[diagram p5: board, bottom side, seen from below]

Outline 100 x 60 mm; copper layers: Top Layer, Bottom Layer. Coordinates in mm from the lower left corner of the outline.
Outline path: rectangle 0,60 100,0
Stack: Top Layer 0.035mm / Dielectric1 1.51mm FR4 er 4.5 / Bottom Layer 0.035mm

## Design rules (mm)
template: JLCPCB Capability(Two Layers Board)
spacing copperThickness1oz (default): track to track 0.102, other pairs 0.152 to 0.3
spacing copperThickness2oz: track to track 0.203, other pairs 0.152 to 0.3
track width copperThickness1oz (default): min 0.127, default 0.254, max 2.54
track width copperThickness2oz: min 0.203, default 0.254, max 2.54
differential pair differentialPair (default): width min 0.127, default 0.254, max 2.54; gap min 0.152, default 0.152
via viaSize (default): diameter min 0.5, default 0.61, max 10; hole min 0.3, default 0.305, max 6.3

## Placement (name value [footprint] x y rotation side)
C1  0.1uF  [C1206]  20.34 9.13 90 bottom
C2  0.1uF  [C1206]  22.22 15.8 0 bottom
C3  47uF  [CAP-TH_BD8.0-P3.50-D0.6-FD]  15.88 9.07 270 top
C4  22uF  [CAP-TH_BD8.0-P3.50-D0.6-FD]  17.91 19.87 270 top
H4  -  [JST 2.54 3 pin]  66.93 11.61 90 top
H17  ds18b20  [JST 2.54 3 pin]  40.39 11.61 90 top
H18  I2C (sensors)  [JST 2.54*4]  51.94 11.61 90 top
H19  TFT(1-3)  [JST 2.54 3 pin]  56.01 51.11 270 top
H20  TFT(4-7)  [JST 2.54*4]  43.94 51.11 270 top
H21  -  [JST 2.54 2 pin]  18.54 52.25 0 top
H23  -  [JST 2.54 2 pin]  18.67 43.36 0 top
H25  -  [JST 2.54 3 pin]  83.69 20.25 90 top
H27  -  [JST 2.54 3 pin]  83.82 34.09 90 top
H29  -  [JST 2.54 3 pin]  83.69 27.11 90 top
H31  -  [JST 2.54 3 pin]  83.95 41.33 90 top
H33  -  [JST 2.54 3 pin]  83.95 48.44 90 top
R12  100  [R1206]  48.26 41.58 0 bottom
R14  100  [R1206]  48.35 38.26 0 bottom
R16  100  [R1206]  48.35 31.86 0 bottom
R18  100  [R1206]  48.35 35.17 0 bottom
R20  100  [R1206]  48.35 28.83 0 bottom
R21  4k7  [R1206]  34.8 10.72 180 bottom
U3  -  [ESP32 DEVKIT V1]  71.76 45.14 270 top
U4  AMS1117-3.3  [SOT-223-3_L6.5-W3.4-P2.30-LS7.0-BR]  26.8 10.85 180 bottom

## Footprints (pads in the part's own frame, mm; a bottom-side part is the same pattern mirrored in y, then rotated)
C1206
  rect 1.485x1.728 smd: 1(-1.593,0) 2(1.593,0)
CAP-TH_BD8.0-P3.50-D0.6-FD
  round 1.8 hole 0.3x1: 1(-1.75,0) 2(1.75,0)
ESP32 DEVKIT V1
  round 1.8 hole 0.914x0.3: 1(0,0) 2(0,-2.54) 3(0,-5.08) 4(0,-7.62) 5(0,-10.16) 6(0,-12.7) 7(0,-15.24) 8(0,-17.78) 9(0,-20.32) 10(0,-22.86) 11(0,-25.4) 12(0,-27.94) 13(0,-30.48) 14(0,-33.02) 15(0,-35.56) 16(25.4,-35.56) 17(25.4,-33.02) 18(25.4,-30.48) 19(25.4,-27.94) 20(25.4,-25.4) 21(25.4,-22.86) 22(25.4,-20.32) 23(25.4,-17.78) 24(25.4,-15.24) 25(25.4,-12.7) 26(25.4,-10.16) 27(25.4,-7.62) 28(25.4,-5.08) 29(25.4,-2.54) 30(25.4,0)
JST 2.54 2 pin
  round 1.8 hole 1.5x0.3: 1(0,0) 2(0,-2.54)
JST 2.54 3 pin
  round 1.8 hole 0.914x0.3: 1(0,0) 2(0,-2.54) 3(0,-5.08)
JST 2.54*4
  round 1.8 hole 0.914x0.3: 1(0,0) 2(0,-2.54) 3(0,-5.08) 4(0,-7.62)
R1206
  rect 1.208x1.701 smd: 1(-1.479,0) 2(1.479,0)
SOT-223-3_L6.5-W3.4-P2.30-LS7.0-BR
  rect 2.5x1.1 smd: 1(2.97,-2.3) 2(2.97,0) 3(2.97,2.3)
  rect 2.34x3.6 smd: 4(-2.97,0)

## Nets
As in the schematic.

Pads without a net: U3 1 2 3 4 5 6 8 9 14 16 19 27 28 30

## Via types
v1: diameter 1.8, hole 0.305, Top Layer to Bottom Layer, 5 vias
v2: diameter 1.8, hole 0.3, Top Layer to Bottom Layer, 3 vias

## Routing (per net, layer and track width the routed paths; a pad name or vN(x,y) marks a point on that pad's centre or on a via; arc(x,y) is an arc through that point)
+3V3: length 100.9
  Bottom Layer w0.254: 32.89,10.85 33.19,10.85
  Bottom Layer w0.8: H18.1 51.94,9.45 50.04,7.55 33.65,7.55 33.27,7.93 33.27,10.47 32.89,10.85 ; 33.27,16.44 35.43,14.28 40.26,14.28 H17.2 ; 33.27,16.44 33.27,16.57 29.85,19.99 29.85,48.95 32.13,51.24 36.2,51.24 H20.4 ; 33.27,16.44 33.27,11.44 32.69,10.85 U4.4 U4.2 23.7,10.73 20.34,10.73 20.24,10.82 C3.1
+5V: length 236
  Top Layer w0.254: v1(22.61,43.36) 27.56,43.36 32.89,38.03 v1(36.2,38.03)
  Bottom Layer w0.8: v1(36.2,38.03) 36.2,35.36
  Bottom Layer w1: 64.14,7.8 59.18,2.85 17.02,2.85 9.4,10.47 9.4,16.06 ; 64.14,7.8 66.93,10.6 H4.1 ; 64.14,7.8 65.02,6.91 81.53,6.91 92.84,18.22 92.84,48.57 90.68,50.73 87.76,50.73 86.49,49.46 H33.2 H31.2 ; 9.4,16.06 14.73,21.39 20.19,21.39 23.83,17.76 U4.3 ; 9.4,16.06 9.4,37.65 15.11,43.36 H23.1 v1(22.61,43.36) ; v1(36.2,38.03) U3.15
GND: length 271.3
  Top Layer w0.254: v1(13.33,25.96) 13.46,25.84 v1(13.46,14.53)
  Bottom Layer w0.8: C2.1 18.8,15.8 17.91,16.69 17.91,16.95
  Bottom Layer w1: C4.2 17.91,16.95 15.49,14.53 v1(13.46,14.53) 12.7,13.77 12.7,9.83 15.34,7.2 16.94,7.2 17.29,7.54 C1.1 22.85,7.54 23.5,8.18 26.42,5.26 54.99,5.26 56.9,7.17 56.9,11.87 ; H18.3 57.02,9.45 61.21,9.45 66.04,14.28 68.76,14.28 69.47,13.57 H4.2 69.47,10.2 70.34,9.33 80.26,9.33 88.77,17.84 H25.3 H29.3 88.9,27.23 88.9,34.09 89.03,34.22 H31.3 H33.3 ; H17.3 45.47,14.15 42.74,16.88 40.07,16.88 38.86,18.09 38.86,19.61 U3.17 38.73,21.52 31.75,28.5 31.75,47.55 33.4,49.2 38.1,49.2 38.86,49.97 38.86,51.36 35.69,54.54 17.53,54.54 16.13,53.14 16.13,51.49 17.91,49.71 H21.2 21.72,49.71 25.02,46.41 25.02,41.97 23.88,40.82 H23.2 18.67,31.3 v1(13.33,25.96)
(no net): length 14
  Bottom Layer w0.8: 36.2,32.19 38.73,34.73 U3.14
GPIO4: length 24.5
  Bottom Layer w0.6: R21.1 39.5,10.72 H17.1 40.39,10.22 41.4,9.2 46.48,9.2 48.26,10.98 48.26,15.93 46.36,17.84 U3.20
GPIO5: length 62.4
  Top Layer w0.254: v1(74.8,48.57) 74.8,43.87 v2(54.1,23.17)
  Bottom Layer w0.8: H19.2 53.47,52.25 54.61,53.4 69.98,53.4 v1(74.8,48.57) ; U3.23 53.98,23.04 v2(54.1,23.17)
GPIO12: length 4.8
  Bottom Layer w0.8: U3.12 43.82,44.55 R12.1
GPIO13: length 9.2
  Bottom Layer w0.8: U3.13 41.27,43.85 R14.1
GPIO14: length 14
  Bottom Layer w0.8: U3.11 46.36,52 45.08,53.27 42.29,53.27 41.4,52.38 H20.2
GPIO15: length 43.4
  Bottom Layer w0.8: H20.1 43.94,49.33 42.16,47.55 34.54,47.55 33.53,46.54 33.53,29.27 41.27,21.52 U3.18
GPIO18: length 16.4
  Bottom Layer w0.8: R20.1 46.87,28.12 48.77,26.22 54.36,26.22 56.52,24.06 U3.24
GPIO19: length 29.1
  Bottom Layer w0.8: U3.25 62.74,23.42 72.77,23.42 74.8,21.39 74.8,14.41 H4.3
GPIO21: length 11.1
  Bottom Layer w0.8: H18.2 54.48,12.63 U3.26
GPIO22: length 14.2
  Bottom Layer w0.5: H18.4 59.56,13.64 62.86,16.95 66.42,16.95 U3.29
GPIO27: length 6.9
  Bottom Layer w0.8: 50.93,51.24 50.93,49.2 48.89,47.17 U3.10
GPIO33: length 6.3
  Bottom Layer w0.8: 56.01,51.24 56.39,50.86 56.39,45.27 U3.7
RX2: length 20.8
  Bottom Layer w0.8: R18.1 45.28,35.17 42.55,32.44 42.55,26.09 U3.21
TX2: length 16.9
  Bottom Layer w0.8: R16.1 45.65,31.86 44.2,30.41 44.2,26.98 U3.22
$1N8540: length 37.4
  Bottom Layer w0.8: H25.1 75.12,28.83 49.82,28.83
$1N8670: length 117.1
  Top Layer w0.254: v2(30.61,15.17) 77.6,15.17 v2(77.72,15.3)
  Bottom Layer w1: v2(30.61,15.17) 28.07,17.71 28.07,47.17 22.99,52.25 H21.1 ; v2(77.72,15.3) 82.68,15.3 86.23,18.85 H25.2 H29.2 86.36,27.23 H27.2
$1N8905: length 34.4
  Bottom Layer w0.8: H27.1 82.74,35.17 49.82,35.17
$1N8909: length 35.8
  Bottom Layer w0.8: H29.1 78.93,31.86 49.82,31.86
$1N9454: length 35.4
  Bottom Layer w0.8: H31.1 80.87,38.26 49.82,38.26
$1N9461: length 37
  Bottom Layer w0.8: R12.2 77.09,41.58 H33.1

## Copper pours and planes (outline as drawn; the poured copper is in the pictures)
+5V on Bottom Layer: 35.31,42.24 37.08,42.24 37.08,40.47 35.31,40.47
+5V on Bottom Layer: 35.23,36.32 37.16,36.32 37.16,34.4 35.23,34.4
(no net) on Bottom Layer: 37.85,42.26 39.62,42.26 39.62,40.49 37.85,40.49
(no net) on Bottom Layer: 35.22,33.16 37.17,33.16 37.17,31.21 35.22,31.21

# Board PCB3
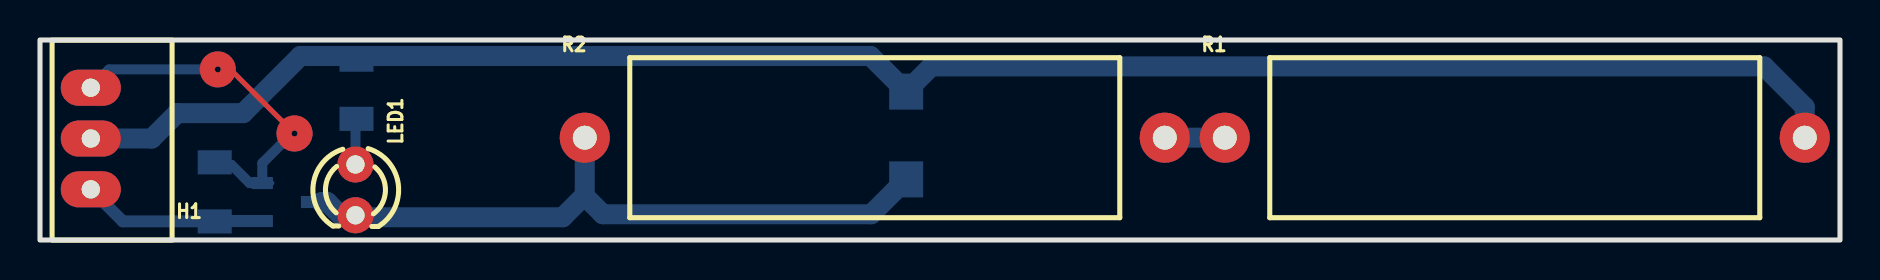
[diagram p6: board, top side]
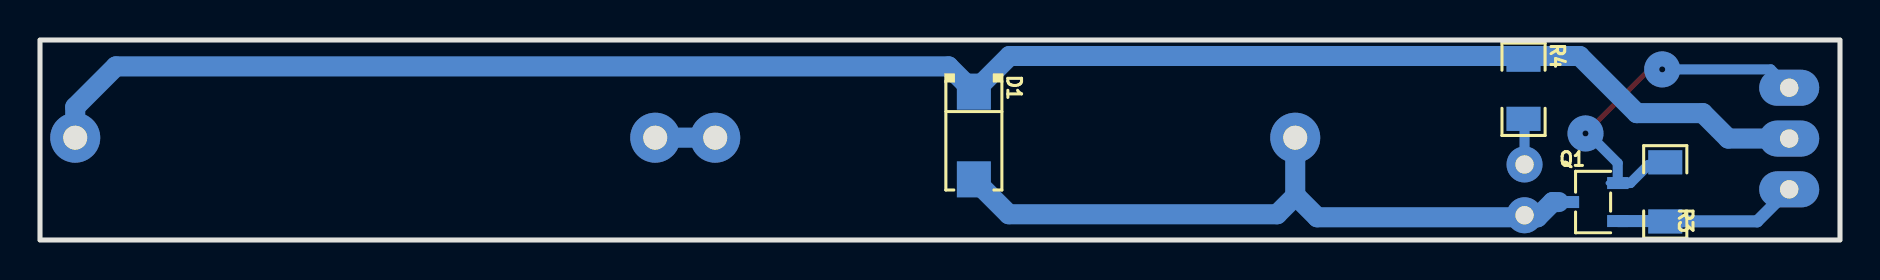
[diagram p7: board, bottom side, seen from below]

Outline 90 x 10 mm; copper layers: Top Layer, Bottom Layer. Coordinates in mm from the lower left corner of the outline.
Outline path: rectangle 0,10 90,0
Stack: Top Layer 0.035mm / Dielectric1 1.51mm FR4 er 4.5 / Bottom Layer 0.035mm

## Design rules (mm)
template: JLCPCB Capability(Two Layers Board)
spacing copperThickness1oz (default): track to track 0.102, other pairs 0.152 to 0.3
spacing copperThickness2oz: track to track 0.203, other pairs 0.152 to 0.3
track width copperThickness1oz (default): min 0.127, default 0.254, max 2.54
track width copperThickness2oz: min 0.203, default 0.254, max 2.54
differential pair differentialPair (default): width min 0.127, default 0.254, max 2.54; gap min 0.152, default 0.152
via viaSize (default): diameter min 0.5, default 0.61, max 10; hole min 0.3, default 0.305, max 6.3

## Placement (name value [footprint] x y rotation side)
D1  SS14  [SMA_L4.4-W2.6-LS5.0-RD]  43.31 5.22 270 bottom
H1  -  [JST 2.54 3 pin]  2.54 2.53 180 top
LED1  -  [LED-TH_BD3.0-P2.54-FD]  15.77 2.51 270 top
Q1  DMN2056U-7  [SOT-23-3_L2.9-W1.6-P1.90-LS2.8-BR]  12.34 1.9 180 bottom
R1  5Ω  [RES-TH_BD8.0-L24.5-P28.50-D0.8]  73.74 5.11 0 top
R2  5Ω  [RES-TH_BD8.0-L24.5-P28.50-D0.8]  41.74 5.11 0 top
R3  10k  [R1206]  8.74 2.41 90 bottom
R4  500  [R1206]  15.82 7.54 270 bottom

## Footprints (pads in the part's own frame, mm; a bottom-side part is the same pattern mirrored in y, then rotated)
JST 2.54 3 pin
  oval 3x1.8 hole 0.914x0.3: 1(0,0) 2(0,-2.54) 3(0,-5.08)
LED-TH_BD3.0-P2.54-FD
  round 1.8 hole 0.914x0.3: 1(-1.27,0) 2(1.27,0)
R1206
  rect 1.208x1.701 smd: 1(-1.479,0) 2(1.479,0)
RES-TH_BD8.0-L24.5-P28.50-D0.8
  round 2.5 hole 1.2x0.8: 1(-14.5,0) 2(14.5,0)
SMA_L4.4-W2.6-LS5.0-RD
  rect 1.8x1.7 smd: 1(-2.192,0) 2(2.192,0)
SOT-23-3_L2.9-W1.6-P1.90-LS2.8-BR
  rect 1.07x0.6 smd: 1(1.235,-0.95) 2(1.235,0.95) 3(-1.235,0)

## Nets
As in the schematic.

## Via types
v1: diameter 1.8, hole 0.305, Top Layer to Bottom Layer, 2 vias

## Routing (per net, layer and track width the routed paths; a pad name or vN(x,y) marks a point on that pad's centre or on a via; arc(x,y) is an arc through that point)
$1N235: length 91
  Bottom Layer w1: H1.2 5.59,5.07 6.86,6.34 10.16,6.34 13.02,9.2 41.52,9.2 D1.1 44.57,8.68 86.21,8.68 88.24,6.65 R1.2
$1N244: length 18.4
  Top Layer w0.254: v1(12.73,5.33) 9.52,8.53 v1(8.89,8.53)
  Bottom Layer w0.254: 11.12,2.85 11.59,2.85
  Bottom Layer w0.5: 8.64,3.76 9.57,3.76 10.48,2.85 11.12,2.85 11.12,3.84 12.34,5.07 12.47,5.07 v1(12.73,5.33) ; H1.3 3.46,8.53 v1(8.89,8.53)
$1N250: length 9.3
  Bottom Layer w0.6: H1.1 4.14,0.93 8.5,0.93 8.64,0.8 8.78,0.95 Q1.1
$1N253: length 34
  Bottom Layer w1: R2.1 27.24,2.24 ; 27.24,2.24 26.14,1.14 15.13,1.14 14.37,1.9 14.06,1.9 ; 27.24,2.24 27.24,2.19 28.14,1.29 41.56,1.29 D1.2
$1N257: length 3
  Bottom Layer w1: R2.2 R1.1
$1N463: length 2.4
  Bottom Layer w0.5: 16.15,6.06 15.77,5.68 LED1.1
